# EAGLE design Mini mp3 (EAGLE 9.6.2)
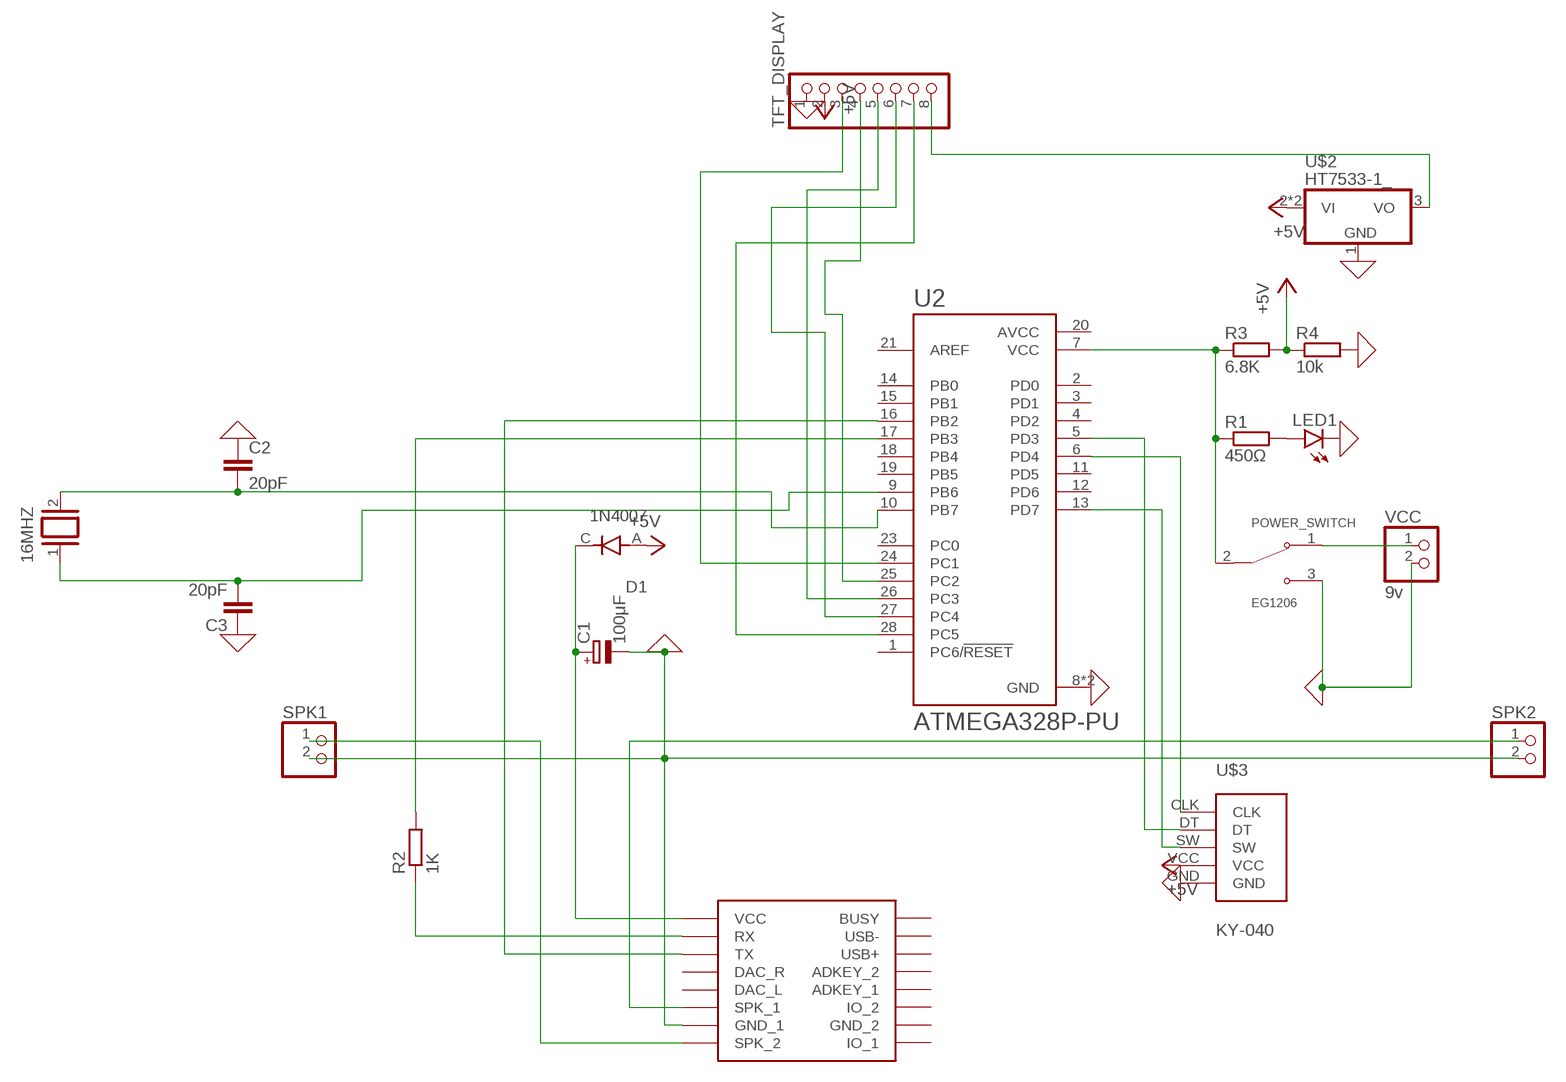
[diagram p0: schematic, sheet 1]

## Parts
16MHZ  XTAL/S  [QS]
C1  100μF  CPOL-EUE2.5-7  [E2,5-7]
C2  20pF  C-EU025-025X050  [C025-025X050]
C3  20pF  C-EU025-025X050  [C025-025X050]
D1  1N4007  [DIOAD1060W80L520D270]
LED1  LED5MM  [LED5MM]
POWER_SWITCH  EG1206  [SW_EG1206]
R1  450Ω  R-EU_0204/7  [0204/7]
R2  1K  R-EU_0204/7  [0204/7]
R3  6.8K  R-EU_0204/7  [0204/7]
R4  10k  R-EU_0204/7  [0204/7]
SPK1  PINHD-1X2  [1X02]
SPK2  PINHD-1X2  [1X02]
TFT_DISPLAY  PINHD-1X8  [1X08]
U2  ATMEGA328P-PU  [DIP794W46P254L2967H457Q28B]
U$1  DFPLAYER  [DFPLAYER]
U$2  HT7533-1_  [SOT89]
U$3  KY-040  [KY-040-PORT]
VCC  9v  PINHD-1X2  [1X02]

## Nets
0: C2.1 C3.1 LED1.K(C) POWER_SWITCH.3 R4.2 TFT_DISPLAY.1 U2.8(GND) U2.22(GND) U$2.1(GND) U$3.GND VCC.2 ; supply symbol labelled GND
+5V: D1.A R3.2 R4.1 TFT_DISPLAY.2 U$2.2(VI) U$2.2@1(VI) U$3.VCC
N$1: R2.2 U2.17(PB3)
N$2: U2.16(PB2) U$1.TX
N$3: TFT_DISPLAY.6 U2.27(PC4)
N$4: SPK1.1 U$1.SPK2(SPK_2)
N$5: TFT_DISPLAY.8 U$2.3(VO)
N$6: TFT_DISPLAY.7 U2.28(PC5)
N$7: TFT_DISPLAY.5 U2.26(PC3)
N$8: TFT_DISPLAY.4 U2.25(PC2)
N$9: TFT_DISPLAY.3 U2.24(PC1)
N$10: C1.- SPK1.2 SPK2.2 U$1.GND_1 ; supply symbol labelled GND
N$11: C1.+ D1.C U$1.VCC
N$12: POWER_SWITCH.2 R1.1 R3.1 U2.7(VCC)
N$13: POWER_SWITCH.1 VCC.1
N$14: R2.1 U$1.RX
N$15: U2.13(PD7) U$3.SW
N$16: U2.5(PD3) U$3.DT
N$17: 16MHZ.2 C2.2 U2.10(PB7)
N$18: 16MHZ.1 C3.2 U2.9(PB6)
N$19: LED1.A R1.2
N$20: U2.6(PD4) U$3.CLK
S: SPK2.1 U$1.SPK1(SPK_1)
Unconnected: U2.1(PC6/!RESET) U2.2(PD0) U2.3(PD1) U2.4(PD2) U2.11(PD5) U2.12(PD6) U2.14(PB0) U2.15(PB1) U2.18(PB4) U2.19(PB5) U2.21(AREF) U2.23(PC0) U$1.ADKEY1(ADKEY_1) U$1.ADKEY2(ADKEY_2) U$1.BUSY U$1.DAC_L U$1.DAC_R U$1.GND_2 U$1.IO1(IO_1) U$1.IO2(IO_2) U$1.USB+ U$1.USB-

## Power pins joined to a net without a drawn wire
AVCC: U2.20(AVCC)

## Library data of the parts
16MHZ = special:XTAL/S: CRYSTAL; SPICEPREFIX: B
C1 = rcl:CPOL-EU: POLARIZED CAPACITOR, European symbol; SPICEPREFIX: C
C2 C3 = rcl:C-EU: CAPACITOR, European symbol; SPICEPREFIX: C
D1 = 1N4007:1N4007: Diode Switching 1KV 1A 2-Pin DO-41 Check availability <https://pricing.snapeda.com/parts/1N4007/Diotec%20Semiconductor/view-part?ref=eda>; AVAILABILITY: In Stock; CHECK_PRICES: https://www.snapeda.com/parts/1N4007/Diotec/view-part/?ref=eda; DESCRIPTION: Diode Standard 1000 V 1A Through Hole DO-41/DO-204AC; MF: Diotec Semiconductor; MP: 1N4007; PACKAGE: DO-41-2 Diotec; PRICE: None; SNAPEDA_LINK: https://www.snapeda.com/parts/1N4007/Diotec/view-part/?ref=snap
LED1 = led:LED: LED OSRAM: - CHIPLED LG R971, LG N971, LY N971, LG Q971, LY Q971, LO R971, LY R971 LH N974, LH R974 LS Q976, LO Q976, LY Q976 LO Q996 - Hyper CHIPLED LW Q18S LB Q993, LB Q99A, LB R99A - SideLED LS A670, LO A670, LY A670, LG A670, LP A670 LB A673, LV A673, LT A673, LW A673 LH A674 LY A675 LS A676, LA A676, LO A676, LY A676, LW A676 LS A679, LY A679, LG A679 - Hyper Micro SIDELED® LS Y876, LA Y876, LO Y876, LY Y876 LT Y87S - SmartLED LW L88C, LW L88S LB L89C, LB L89S, LG L890 LS L89K, LO L89K, LY L89K LS L896, LA L896, LO L896, LY L896 - TOPLED LS T670, LO T670, LY T670, LG T670, LP T670 LSG T670, LSP T670, LSY T670, LOP T670, LYG T670 LG T671, LOG T671, LSG T671 LB T673, LV T673, LT T673, LW T673 LH T674 LS T676, LA T676, LO T676, LY T676, LB T676, LH T676, LSB T676, LW T676 LB T67C, LV T67C, LT T67C, LS T67K, LO T67K, LY T67K, LW E67C LS E67B, LA E67B, LO E67B, LY E67B, LB E67C, LV E67C, LT E67C LW T67C LS T679, LY T679, LG T679 LS T770, LO T770, LY T770, LG T770, LP T770 LB T773, LV T773, LT T773, LW T773 LH T774 LS E675, LA E675, LY E675, LS T675 LS T776, LA T776, LO T776, LY T776, LB T776 LHGB T686 LT T68C, LB T68C - Hyper Mini TOPLED® LB M676 - Mini TOPLED Santana® LG M470 LS M47K, LO M47K, LY M47K Source: http://www.osram.convergy.de LUXEON: - LUMILED® LXK2-PW12-R00, LXK2-PW12-S00, LXK2-PW14-U00, LXK2-PW14-V00 LXK2-PM12-R00, LXK2-PM12-S00, LXK2-PM14-U00 LXK2-PE12-Q00, LXK2-PE12-R00, LXK2-PE12-S00, LXK2-PE14-T00, LXK2-PE14-U00 LXK2-PB12-K00, LXK2-PB12-L00, LXK2-PB12-M00, LXK2-PB14-N00, LXK2-PB14-P00, LXK2-PB14-Q00 LXK2-PR12-L00, LXK2-PR12-M00, LXK2-PR14-Q00, LXK2-PR14-R00 LXK2-PD12-Q00, LXK2-PD12-R00, LXK2-PD12-S00 LXK2-PH12-R00, LXK2-PH12-S00 LXK2-PL12-P00, LXK2-PL12-Q00, LXK2-PL12-R00 Source: www.luxeon.com KINGBRIGHT: KA-3528ASYC Source: www.kingbright.com
POWER_SWITCH = EG1206:EG1206: Check availability <https://pricing.snapeda.com/parts/EG1206/E-Switch/view-part?ref=eda>; AVAILABILITY: In Stock; CHECK_PRICES: https://www.snapeda.com/parts/EG1206/E-Switch/view-part/?ref=eda; DESCRIPTION: SWITCH SLIDE SPDT 200MA 30V; MF: E-Switch; MP: EG1206; PACKAGE: None; PRICE: None; PURCHASE-URL: https://www.snapeda.com/api/url_track_click_mouser/?unipart_id=394778&manufacturer=E-Switch&part_name=EG1206&search_term=switch; SNAPEDA_LINK: https://www.snapeda.com/parts/EG1206/E-Switch/view-part/?ref=snap
R1-R4 = rcl:R-EU_: RESISTOR, European symbol; SPICEPREFIX: R
SPK1 SPK2 VCC = pinhead:PINHD-1X2: PIN HEADER
TFT_DISPLAY = pinhead:PINHD-1X8: PIN HEADER
U2 = ATMEGA328P-PU:ATMEGA328P-PU: ATmega Series 20 MHz 32 KB Flash 2 KB SRAM 8-Bit Microcontroller - DIP-28 Check availability <https://pricing.snapeda.com/parts/ATMEGA328P-PU/Microchip/view-part?ref=eda>; AVAILABILITY: In Stock; CHECK_PRICES: https://www.snapeda.com/parts/ATMEGA328P-PU/Microchip/view-part/?ref=eda; DESCRIPTION: AVR AVR® ATmega Microcontroller IC 8-Bit 20MHz 32KB (16K x 16) FLASH 28-PDIP; MF: Microchip; MP: ATMEGA328P-PU; PACKAGE: PDIP-28 Atmel; PRICE: None; PURCHASE-URL: https://www.snapeda.com/api/url_track_click_mouser/?unipart_id=44282&manufacturer=Microchip&part_name=ATMEGA328P-PU&search_term=atmega328p-pu; SNAPEDA_LINK: https://www.snapeda.com/parts/ATMEGA328P-PU/Microchip/view-part/?ref=snap
U$1 = DFPlayer_v1:DFPLAYER
U$2 = HT7533-1:HT7533-1: 合泰稳压芯片75XX-1系列 7533-1，3.3V线性稳压输出 Check availability <https://pricing.snapeda.com/parts/HT7533-1/Holtek/view-part?ref=eda>; AVAILABILITY: Not in stock; CHECK_PRICES: https://www.snapeda.com/parts/HT7533-1/Holtek/view-part/?ref=eda; DESCRIPTION: Smd c.Int. Ht-7533-1 (Sot-89)Tape&Reel h Oltek.; MF: Holtek; MP: HT7533-1; PACKAGE: SOT-89 Holtek; PRICE: None; SNAPEDA_LINK: https://www.snapeda.com/parts/HT7533-1/Holtek/view-part/?ref=snap
U$3 = KY-040:KY-040: Check availability <https://pricing.snapeda.com/parts/KY-040/Joy-IT/view-part?ref=eda>; AVAILABILITY: Not in stock; CHECK_PRICES: https://www.snapeda.com/parts/KY-040/Joy-IT/view-part/?ref=eda; DESCRIPTION: KY-5.0-4P Green(RAL6018/T) ; CONTACT WITH TIN PLATED MARK; MF: Joy-IT; MP: KY-040; PACKAGE: Package; PRICE: None; SNAPEDA_LINK: https://www.snapeda.com/parts/KY-040/Joy-IT/view-part/?ref=snap

## Board
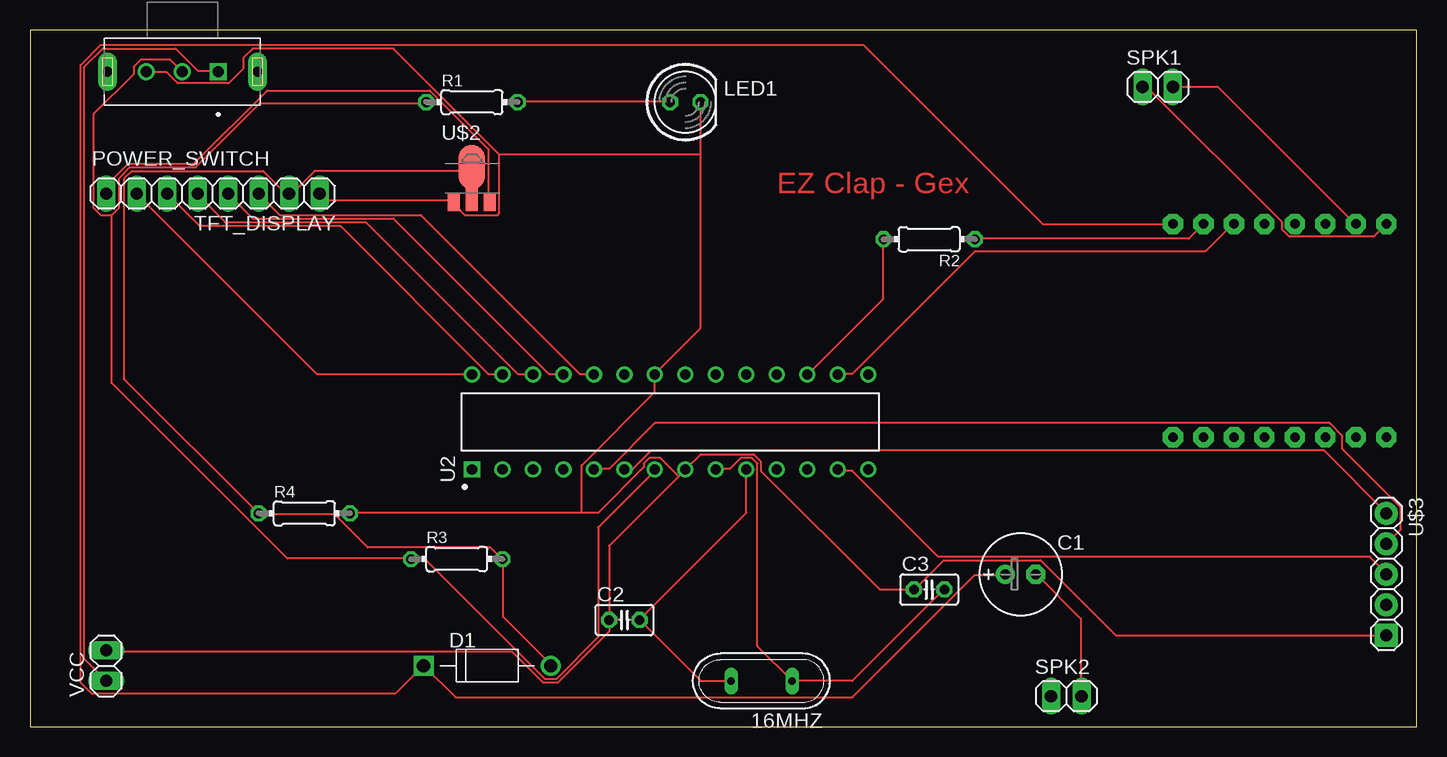
[diagram p1: board, top side]
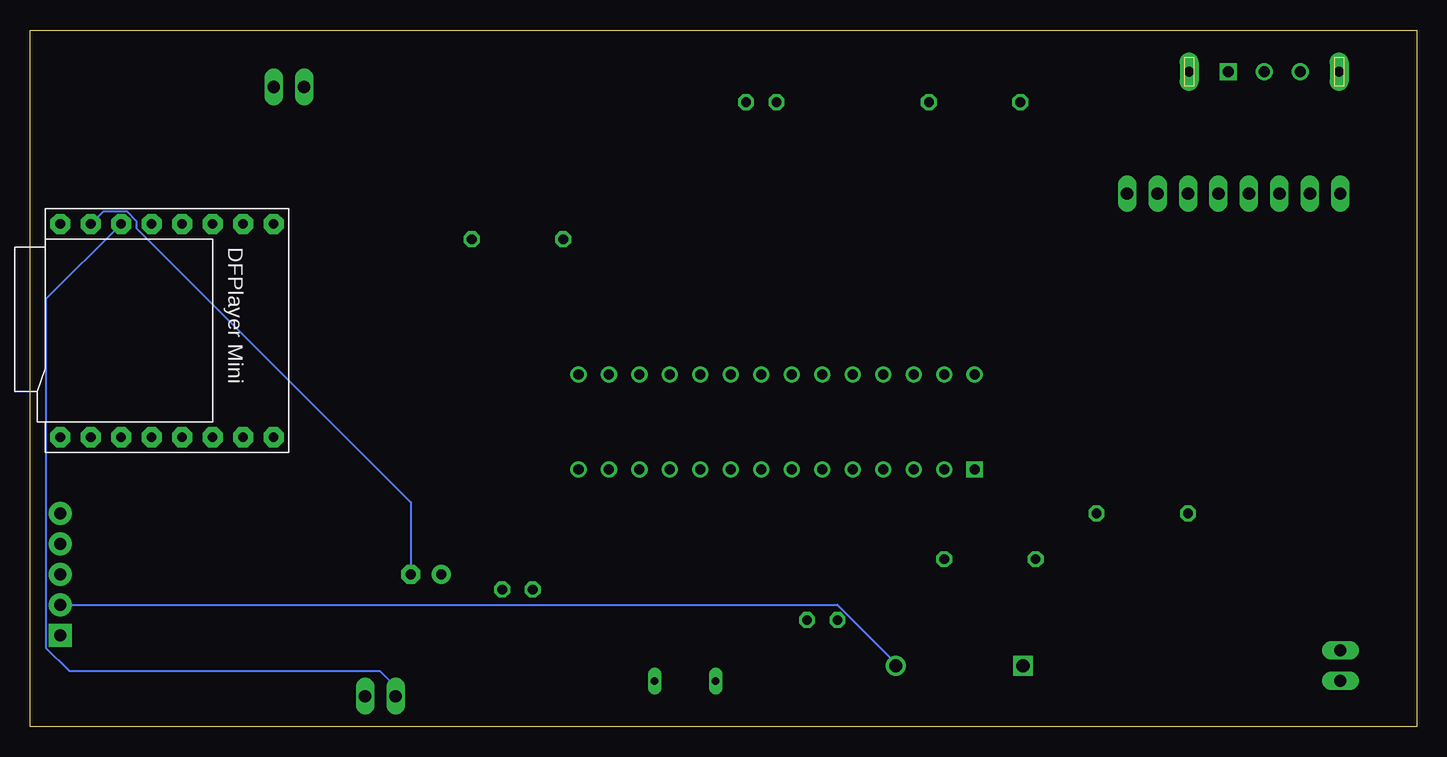
[diagram p2: board, bottom side, seen from below]

Size 115.55 x 58.09 mm. Coordinates in mm from the lower left corner, seen from the top.
Outline: 6.05,53.46 6.05,55.76 6.85,55.76 6.85,53.46 6.05,53.46
Outline: 18.55,53.46 18.55,55.76 19.35,55.76 19.35,53.46 18.55,53.46
Outline: 0,58.09 0,0 115.55,0 115.55,58.09 0,58.09
Copper layers (1*16): Top 0.035mm / dielectric 1.5mm / Bottom 0.035mm
Design rules "default": minimum track width 6mil, minimum drill 0.35mm, track to track 6mil, track to pad 6mil, pad to pad 6mil, via to via 6mil, smd to smd 6mil, copper to edge 40mil, drill to drill 6mil, minimum pad ring 10mil, minimum via ring 8mil, stop-mask expansion 4mil, vias tented up to drill 0mil, thermal gap 10mil

### Footprints (pad centres in the part's own frame; a part is rotated, then mirrored left to right if it is on the bottom)
QS = drill 0.61 long: 1 -2.54,0; 2 2.54,0
E2,5-7 = drill 0.813 pad 1.6: + -1.27,0 | drill 0.813 pad 1.6 octagon: - 1.27,0
C025-025X050 = drill 0.813 octagon: 1 -1.27,0; 2 1.27,0
DIOAD1060W80L520D270 = drill 1.1 pad 1.65: A 5.3,0 | drill 1.1 pad 1.65 square: C -5.3,0
LED5MM = drill 0.813 octagon: A -1.27,0; K 1.27,0
SW_EG1206 = drill 0.9 square: 1 -3,0 | drill 0.9: 2 0,0; 3 3,0 | drill 0.8 pad 1.6 long: SH1 -6.25,0; SH2 6.25,0
0204/7 = drill 0.813 octagon: 1 -3.81,0; 2 3.81,0
1X02 = drill 1.016 long: 1 -1.27,0; 2 1.27,0
1X08 = drill 1.016 long: 1 -8.89,0; 2 -6.35,0; 3 -3.81,0; 4 -1.27,0; 5 1.27,0; 6 3.81,0; 7 6.35,0; 8 8.89,0
DIP794W46P254L2967H457Q28B = drill 0.85 square: 1 -3.96,16.51 | drill 0.85: 2 -3.96,13.97; 3 -3.96,11.43; 4 -3.96,8.89; 5 -3.96,6.35; 6 -3.96,3.81; 7 -3.96,1.27; 8 -3.96,-1.27; 9 -3.96,-3.81; 10 -3.96,-6.35; 11 -3.96,-8.89; 12 -3.96,-11.43; 13 -3.96,-13.97; 14 -3.96,-16.51; 15 3.96,-16.51; 16 3.96,-13.97; 17 3.96,-11.43; 18 3.96,-8.89; 19 3.96,-6.35; 20 3.96,-3.81; 21 3.96,-1.27; 22 3.96,1.27; 23 3.96,3.81; 24 3.96,6.35; 25 3.96,8.89; 26 3.96,11.43; 27 3.96,13.97; 28 3.96,16.51
DFPLAYER = drill 0.8 pad 1.676 octagon: ADKEY1 8.89,-1.27; ADKEY2 8.89,1.27; BUSY 8.89,8.89; DAC_L -8.89,-1.27; DAC_R -8.89,1.27; GND_1 -8.89,-6.35; GND_2 8.89,-6.35; IO1 8.89,-8.89; IO2 8.89,-3.81; RX -8.89,6.35; SPK1 -8.89,-3.81; SPK2 -8.89,-8.89; TX -8.89,3.81; USB+ 8.89,3.81; USB- 8.89,6.35; VCC -8.89,8.89
SOT89 = smd 1 x 1.5: 1 -1.499,-1.981; 3 1.499,-1.981 | smd 1 x 2: 2 0,-1.727 | smd 2.2 x 3.7: 2@1 0,0.94
KY-040-PORT = drill 1.016 pad 1.93: CLK -6.35,0; DT -3.81,0; SW -1.27,0; VCC 1.27,0 | drill 1.016 pad 1.93 square: GND 3.81,0

### Placement (x,y rotation side)
16MHZ  60.96,3.81 180 top
C1  82.55,12.7 0 top
C2  49.53,8.89 0 top
C3  74.93,11.43 0 top
D1  38.1,5.08 0 top
LED1  54.61,52.07 0 top
POWER_SWITCH  12.7,54.61 180 top
R1  36.83,52.07 0 top
R2  74.93,40.64 180 top
R3  35.56,13.97 0 top
R4  22.86,17.78 0 top
SPK1  93.98,53.34 0 top
SPK2  86.36,2.54 0 top
TFT_DISPLAY  15.24,44.45 180 top
U2  53.34,25.4 90 top
U$1  104.14,33.02 270 bottom
U$2  36.83,45.72 0 top
U$3  113.03,11.43 270 top
VCC  6.35,5.08 90 top

### Tracks (layer width: path | path; a pad name or v marks a point on that pad's centre or on a via)
0
  Top 0.152: TFT_DISPLAY.1 24.18,44.35 24.64,43.89 35.31,43.89 U$2.1 35.46,43.74 35.46,43.43 36.22,42.67 38.96,42.67 39.12,42.82 39.12,47.7 | 39.12,47.7 30.28,56.54 18.54,56.54 17.78,55.78 17.78,54.86 16.56,53.65 12.29,53.65 11.38,54.56 9.7,54.56 POWER_SWITCH.3 | 55.88,47.7 55.88,33.22 52.07,29.41 U2.22 52.07,27.89 45.97,21.79 45.97,17.83 | 55.88,47.7 LED1.K | 54.05,20.88 54.51,21.34 U2.8 54.66,21.49 55.88,22.71 60.3,22.71 60.91,22.1 60.91,21.34 70.81,11.43 C3.1 73.71,11.43 76.15,13.87 84.23,13.87 90.47,7.62 U$3.GND | 54.05,20.88 48.26,15.09 C2.1 48.26,7.92 43.99,3.66 42.77,3.66 40.18,6.25 6.35,6.25 VCC.2 | 45.97,17.83 47.35,17.83 51.16,21.64 51.16,21.95 51.61,22.4 52.53,22.4 54.05,20.88 | 45.97,17.83 26.77,17.83 R4.2 | 55.88,47.7 39.12,47.7
+5V
  Top 0.152: 36.83,46.33 U$2.2@1 36.83,46.63 | 36.83,46.33 U$2.2 | 21.59,44.5 21.89,44.5 23.72,46.33 36.83,46.33 | D1.A 43.38,5.18 39.42,9.14 39.42,13.87 R3.2 39.27,14.02 38.35,14.94 28.14,14.94 25.4,17.68 19.15,17.68 R4.1 7.87,28.96 7.87,45.72 8.48,46.33 19.46,46.33 21.29,44.5 21.59,44.5 | 21.59,44.5 TFT_DISPLAY.2
  Bottom 0.152: U$3.VCC 48.27,10.16 43.4,5.29 D1.A
N$1
  Top 0.152: R2.2 71.12,35.66 64.87,29.41 U2.17
N$2
  Top 0.152: U2.16 67.31,29.41 68.53,29.41 78.74,39.62 97.94,39.62 100.23,41.91 U$1.TX
N$3
  Top 0.152: TFT_DISPLAY.6 14.12,41.76 25.86,41.76 38.2,29.41 39.27,29.41 U2.27
N$4
  Top 0.152: SPK1.1 93.07,53.34 104.34,42.06 104.34,41.45 104.95,40.84 111.96,40.84 U$1.SPK2
N$5
  Top 0.152: TFT_DISPLAY.8 6.35,45.11 8.18,46.94 13.66,46.94 19.76,53.03 33.33,53.03 38.2,48.16 38.2,43.89 U$2.3
N$6
  Top 0.152: U2.28 36.83,29.41 23.88,29.41 8.94,44.35 TFT_DISPLAY.7
N$7
  Top 0.152: U2.26 41.86,29.41 40.64,29.41 27.99,42.06 16.26,42.06 13.97,44.35 TFT_DISPLAY.5
N$8
  Top 0.152: U2.25 44.45,29.41 43.23,29.41 30.28,42.37 18.54,42.37 16.56,44.35 TFT_DISPLAY.4
N$9
  Top 0.152: TFT_DISPLAY.3 20.83,42.67 32.56,42.67 45.82,29.41 46.89,29.41 U2.24
N$10
  Top 0.152: SPK1.2 99.01,53.34 110.44,41.91 U$1.GND_1 | SPK2.2 87.58,2.59 87.58,8.99 83.92,12.65 C1.-
  Bottom 0.152: U$1.GND_1 109.42,42.98 107.51,42.98 106.68,42.15 106.68,41.56 83.82,18.7 C1.-
N$11
  Top 0.152: C1.+ 81.18,12.65 78.74,12.65 68.53,2.44 35.46,2.44 32.87,5.03 D1.C 32.72,5.03 30.43,2.74 5.13,2.74 4.22,3.66 4.22,55.17 5.89,56.84 69.44,56.84 84.38,41.91 U$1.VCC
N$12
  Top 0.152: 6.81,42.67 7.42,43.28 7.42,45.72 8.33,46.63 13.82,46.63 19.15,51.97 33.02,51.97 R1.1 | 6.81,42.67 5.89,42.67 5.28,43.28 5.28,51.05 8.64,54.41 8.64,55.02 9.25,55.63 11.68,55.63 POWER_SWITCH.2 | U2.7 52.07,21.34 47.35,16.61 47.35,7.47 43.84,3.96 42.93,3.96 33.02,13.87 31.8,13.87 R3.1 31.65,14.02 21.44,14.02 6.81,28.65 6.81,42.67
N$13
  Top 0.152: VCC.1 4.52,5.64 4.52,55.02 6.04,56.54 12.14,56.54 13.97,54.71 15.65,54.71 POWER_SWITCH.1
N$14
  Top 0.152: U$1.RX 96.57,40.69 78.74,40.69 R2.1
N$15
  Top 0.152: U2.13 67.31,21.34 68.53,21.34 75.69,14.17 111.66,14.17 113.03,12.8 U$3.SW
N$16
  Top 0.152: U$3.DT 114.25,16.46 114.25,18.29 109.37,23.16 109.37,24.23 108.31,25.3 52.07,25.3 48.26,21.49 47.04,21.49 U2.5
N$17
  Top 0.152: 16MHZ.2 55.88,3.81 C2.2 50.85,8.99 59.69,17.83 U2.10
N$18
  Top 0.152: C3.2 76.15,11.43 68.53,3.81 16MHZ.1 60.6,6.71 60.6,21.95 60.15,22.4 59.23,22.4 58.32,21.49 57.25,21.49 U2.9
N$19
  Top 0.152: R1.2 40.64,52.12 53.29,52.12 LED1.A
N$20
  Top 0.152: U2.6 49.63,21.49 50.24,21.49 51.77,23.01 107.85,23.01 113.03,17.83 U$3.CLK
S
  Bottom 0.152: U$1.SPK1 114.22,35.64 114.22,6.56 112.3,4.64 86.42,4.64 85.09,3.3 SPK2.1

### Text on the board
Top: EZ Clap - Gex